# EAGLE design 450_mic_Rev020000 (EAGLE 9.6.2)
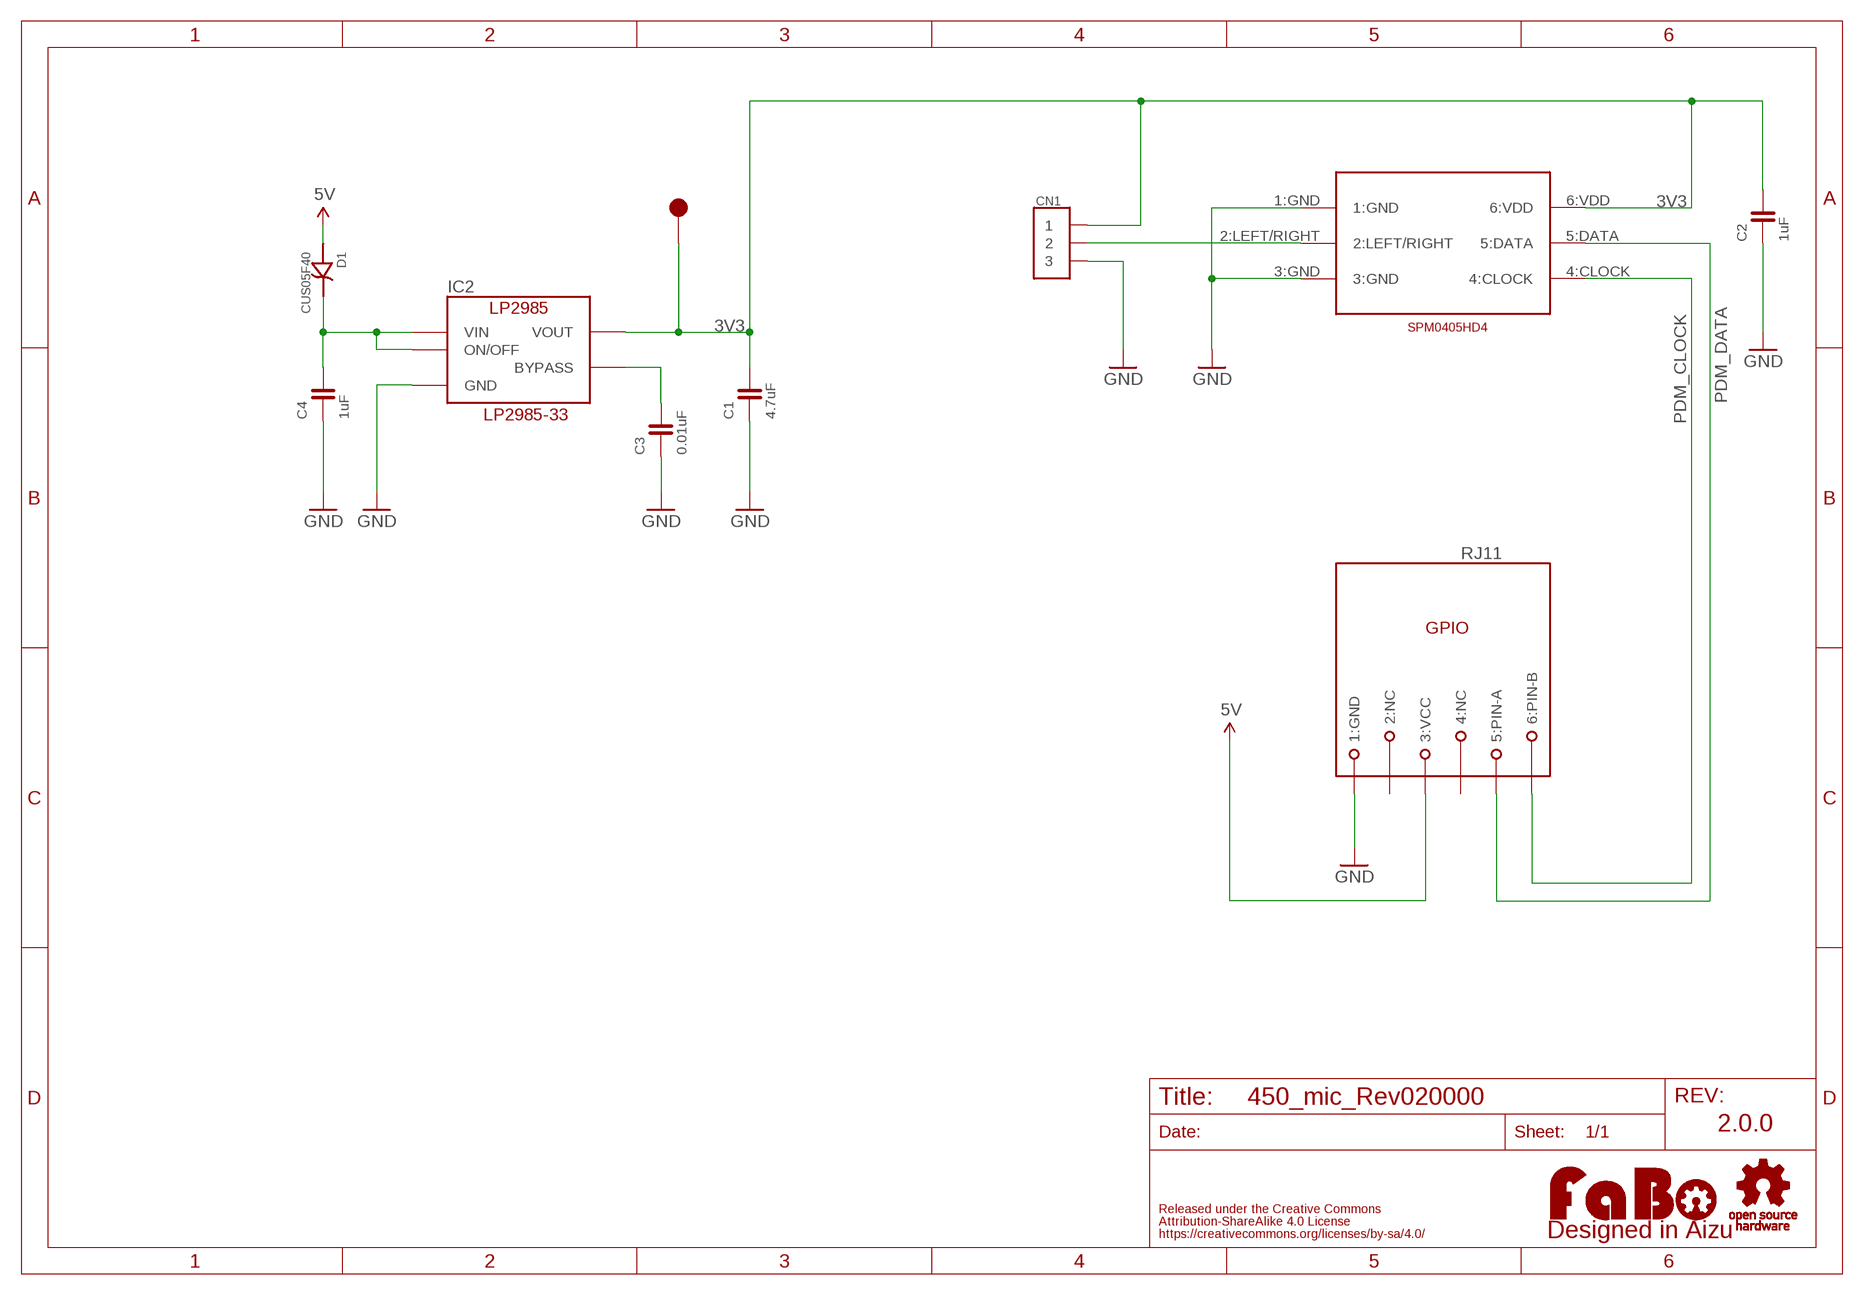
[diagram p0: schematic, sheet 1]

## Parts
C1  4.7uF  CAPACITOR-0603  [0603]
C2  1uF  CAPACITOR-0603  [0603]
C3  0.01uF  CAPACITOR-0603  [0603]
C4  1uF  CAPACITOR-0603  [0603]
CN1  PIN_1X3  [PIN_1X3]
D1  CUS05F40  [CUS05F40]
IC2  LP2985-33DBV  [SOT-23-5]
LOGO1  LOGO_FABO-M  [LOGO_FABO_M]
RJ11  MODULAR-JACK-6P-RJ11_GPIO  [7002-6PXC-X]
TP3  TP-15  [TP-15]
U$2  LOGO_OSHW-M_BOTTOM  [LOGO_OSHW_M_BOTTOM]
U$5  SPM0405H  [SPM4050]

## Nets
3V3: C1.2 C2.2 CN1.1 IC2.5(VOUT) TP3.1 U$5.6:VDD
5V: D1.A(ANODE) RJ11.3(3:VCC)
GND: C1.1 C2.1 C3.1 C4.1 CN1.3 IC2.2(GND) RJ11.1(1:GND) U$5.1:GND U$5.3:GND
N$3: C3.2 IC2.4(BYPASS)
N$4: C4.2 D1.C(CATHODE) IC2.1(VIN) IC2.3(ON/OFF)
N$5: CN1.2 U$5.2:LEFT/RIGHT
PDM_CLOCK: RJ11.6(6:PIN-B) U$5.4:CLOCK
PDM_DATA: RJ11.5(5:PIN-A) U$5.5:DATA
Unconnected: RJ11.2(2:NC) RJ11.4(4:NC)

## Notes on the sheet
- LP2985-33
- 2.0.0

## Library data of the parts
C1-C4 = FaBo-Capacitor:CAPACITOR: CAPACITOR
CN1 = FaBo-PIN:PIN_1X3
D1 = FaBo-Diode:CUS05F40
IC2 = FaBo-Supply:LP2985: LP2985
LOGO1 = component:LOGO_FABO
RJ11 = FaBo-Connetor:MODULAR-JACK-6P-RJ11_GPIO
TP3 = FaBo-Supply:TP
U$2 = FaBo-etc:LOGO_OSHW
U$5 = FaBo-Sensor:SPM0405H

## Board
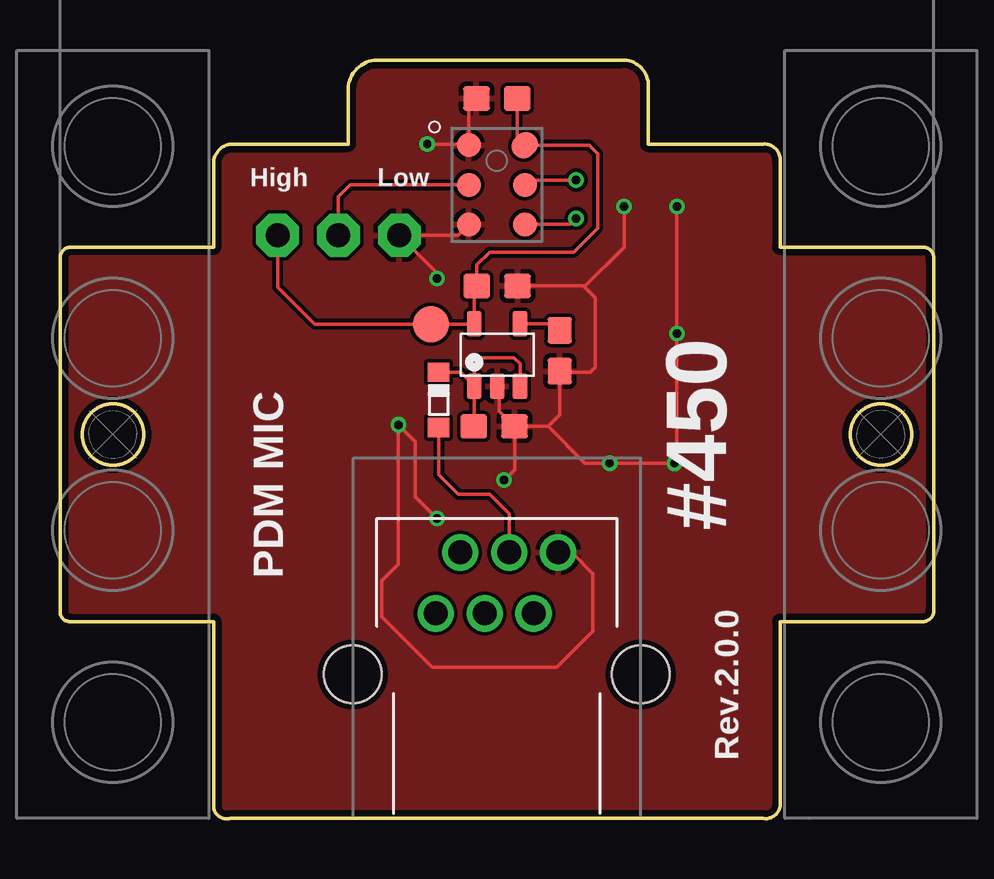
[diagram p1: board, top side]
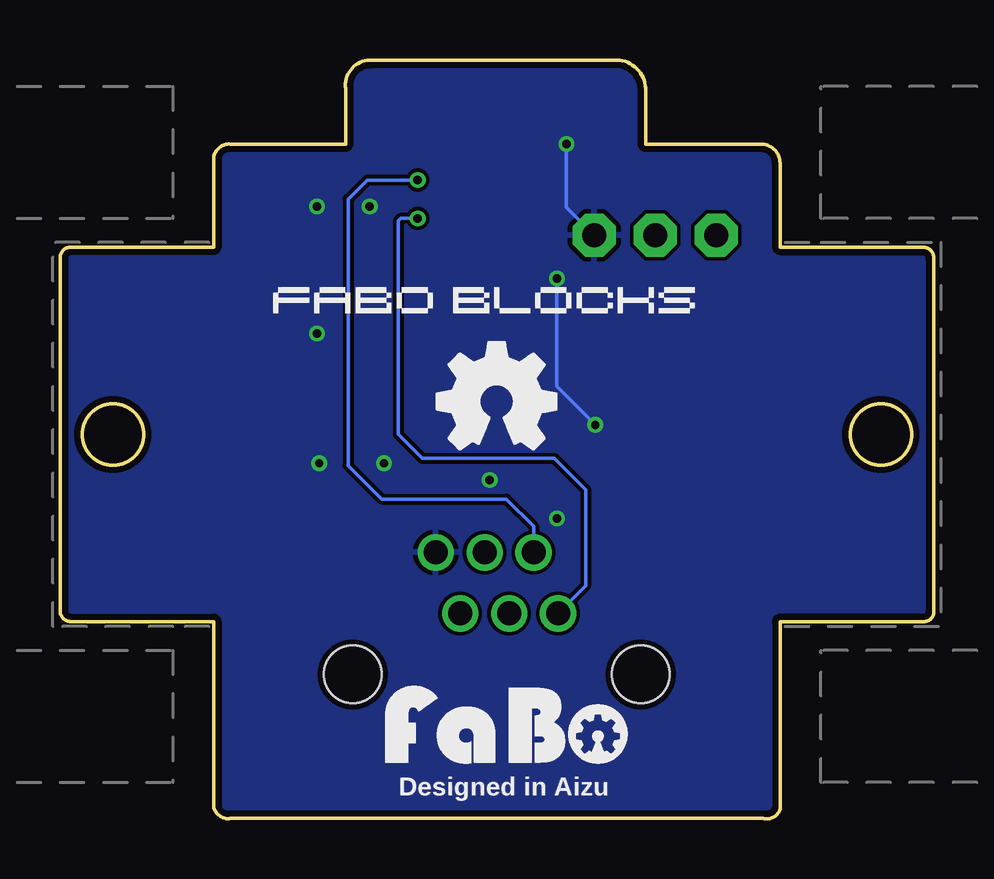
[diagram p2: board, bottom side, seen from below]

Size 36.41 x 31.62 mm. Coordinates in mm from the lower left corner, seen from the top.
Outline: 29.3,0.02 7.1,0.02 arc-90 6.4,0.42 6.4,8.22 0.4,8.22 arc-90 0,8.62 0,23.32 arc-90 0.4,23.82 6.4,23.82 6.4,27.32 arc-90 7.2,28.12 12,28.12 12,30.32 arc-90 13.2,31.62 23.4,31.62 arc-101 24.5,30.42 24.5,28.12 29.3,28.12 arc-99 30,27.42 30,23.82 36,23.82 arc-90 36.4,23.32 36.4,8.72 arc-90 36,8.22 30,8.22 30,0.52 arc-90 29.3,0.02
Outline: circle at 34.2,16.02 radius 1.27
Outline: circle at 2.2,16.02 radius 1.27
Copper layers (1*16): Top 0.035mm / dielectric 1.6mm / Bottom 0.035mm
Design rules "PCBway": minimum track width 6mil, minimum drill 12mil, track to track 6mil, track to pad 6mil, pad to pad 6mil, via to via 6mil, smd to smd 6mil, copper to edge 10mil, drill to drill 10mil, minimum pad ring 10mil, minimum via ring 6mil, stop-mask expansion 2mil, vias tented up to drill 100mil, thermal gap 8mil

### Footprints (pad centres in the part's own frame; a part is rotated, then mirrored left to right if it is on the bottom)
0603 = smd 1.1 x 1: 1 -0.85,0; 2 0.85,0
PIN_1X3 = drill 1 pad 1.778 octagon: 1 -2.54,0; 2 0,0; 3 2.54,0
CUS05F40 = smd 0.8 x 0.9: A -1.15,0; C 1.15,0
SOT-23-5 = smd 0.6 x 1.05: 1 -0.95,-1.3; 2 0,-1.3; 3 0.95,-1.3; 4 0.95,1.3; 5 -0.95,1.3
7002-6PXC-X = drill 1: 1 2.55,5.08; 2 1.53,2.54; 3 0.51,5.08; 4 -0.51,2.54; 5 -1.53,5.08; 6 -2.55,2.54 | hole 2.4: -6,0; 6,0
TP-15 = smd 1.5 x 1.5: 1 0,0
SPM4050 = smd 1 x 1: 1:GND -1.169,1.651; 2:LEFT/RIGHT -1.169,0; 3:GND -1.169,-1.651; 4:CLOCK 1.169,-1.651; 5:DATA 1.169,0 | smd 1.15 x 1 rotated 45: 6:VDD 1.169,1.651

### Placement (x,y rotation side)
C1  18.21,22.21 180 top
C2  18.2,30.02 0 top
C3  20.82,19.51 90 top
C4  18.09,16.36 180 top
CN1  11.6,24.32 0 top
D1  15.78,17.46 90 top
IC2  18.22,19.33 0 top
LOGO1  17.8,1.93 0 bottom
RJ11  18.2,6.02 0 top
TP3  15.46,20.61 0 top
U$2  18.2,17.4 0 top
U$3  [4-1BLOCK]  2.2,16.02 0 top
U$4  [4-1BLOCK]  34.2,16.02 180 top
U$5  18.2,26.42 0 top

### Tracks (layer width: path | path; a pad name or v marks a point on that pad's centre or on a via)
3V3
  Top 0.152: C1.2 17.36,22.32 | 17.36,22.32 17.36,23.08 17.9,23.62 21.4,23.62 22.4,24.62 22.4,27.72 22.05,28.07 U$5.6:VDD 19.05,28.39 C2.2 | CN1.1 9.06,22.16 10.61,20.61 TP3.1 17.25,20.61 IC2.5 17.27,22.23 17.36,22.32
5V
  Top 0.152: D1.A 15.78,14.35 16.6,13.52 17.9,13.52 18.71,12.71 RJ11.3
GND  (via drill 0.35)
  Top 0.152: U$5.3:GND 16.58,24.32 CN1.3 15.7,22.76 v15.7,22.52 | C4.1 18.3,16.99 18.3,17.95 IC2.2 | C4.1 20.34,16.36 | 20.82,18.62 20.82,16.84 20.34,16.36 | 20.82,18.62 C3.1 | C1.1 21.82,22.21 21.85,22.17 | 20.82,18.62 22.1,18.62 22.3,18.82 22.3,21.72 21.85,22.17 | RJ11.1 21.32,11.1 22.2,10.22 22.2,7.82 20.7,6.32 15.5,6.32 13.4,8.42 13.4,9.92 14.1,10.62 v14.1,16.42 14.8,15.72 14.8,13.42 v15.7,12.52 | C2.1 17.03,29.7 U$5.1:GND 16.99,28.12 v15.3,28.12 | v23.5,25.52 23.5,23.82 21.85,22.17 | 20.34,16.36 21.87,14.82 v22.9,14.82 v25.6,14.82 25.7,14.92 v25.7,20.22 v25.7,25.52 | v18.5,14.12 18.94,14.56 C4.1
  Bottom 0.152: v15.7,22.52 15.7,18.02 v14.1,16.42 | v15.3,28.12 15.3,25.48 CN1.3
  pour Bottom: -8.2,43.02 51.9,43.02 51.9,-13.98 -8.2,-13.98
  pour Top: -8.6,44.22 50.9,44.22 50.9,-13.28 -8.6,-13.28
N$3
  Top 0.152: IC2.4 20.55,20.63 C3.2
N$4
  Top 0.152: IC2.3 19.17,18.96 18.9,19.22 17.5,19.22 17.27,18.99 IC2.1 | IC2.1 17.27,16.39 C4.2 | IC2.1 16.69,18.61 D1.C
N$5
  Top 0.152: CN1.2 11.6,25.92 12.1,26.42 U$5.2:LEFT/RIGHT
PDM_CLOCK  (via drill 0.35)
  Top 0.152: U$5.4:CLOCK 21.25,24.77 v21.5,25.02
  Bottom 0.152: v21.5,25.02 22.2,25.02 22.3,24.92 22.3,16.02 21.3,15.02 15.8,15.02 14.5,13.72 14.5,9.71 RJ11.6
PDM_DATA  (via drill 0.35)
  Top 0.152: U$5.5:DATA 19.57,26.62 v21.5,26.62
  Bottom 0.152: v21.5,26.62 23.6,26.62 24.4,25.82 24.4,14.72 23,13.32 17.8,13.32 16.67,12.19 RJ11.5

### Text on the board
tPlace: High | Low | #450 | PDM MIC | Rev.2.0.0
bPlace: Designed in Aizu
Document: #450 Microphone PDM Rev2.0.0 / 2022/07/19 | Note / To inspect the voltage
bDocu: LP2985-33